# EAGLE design Blynk_Watering_System_main (EAGLE 7.5.0)
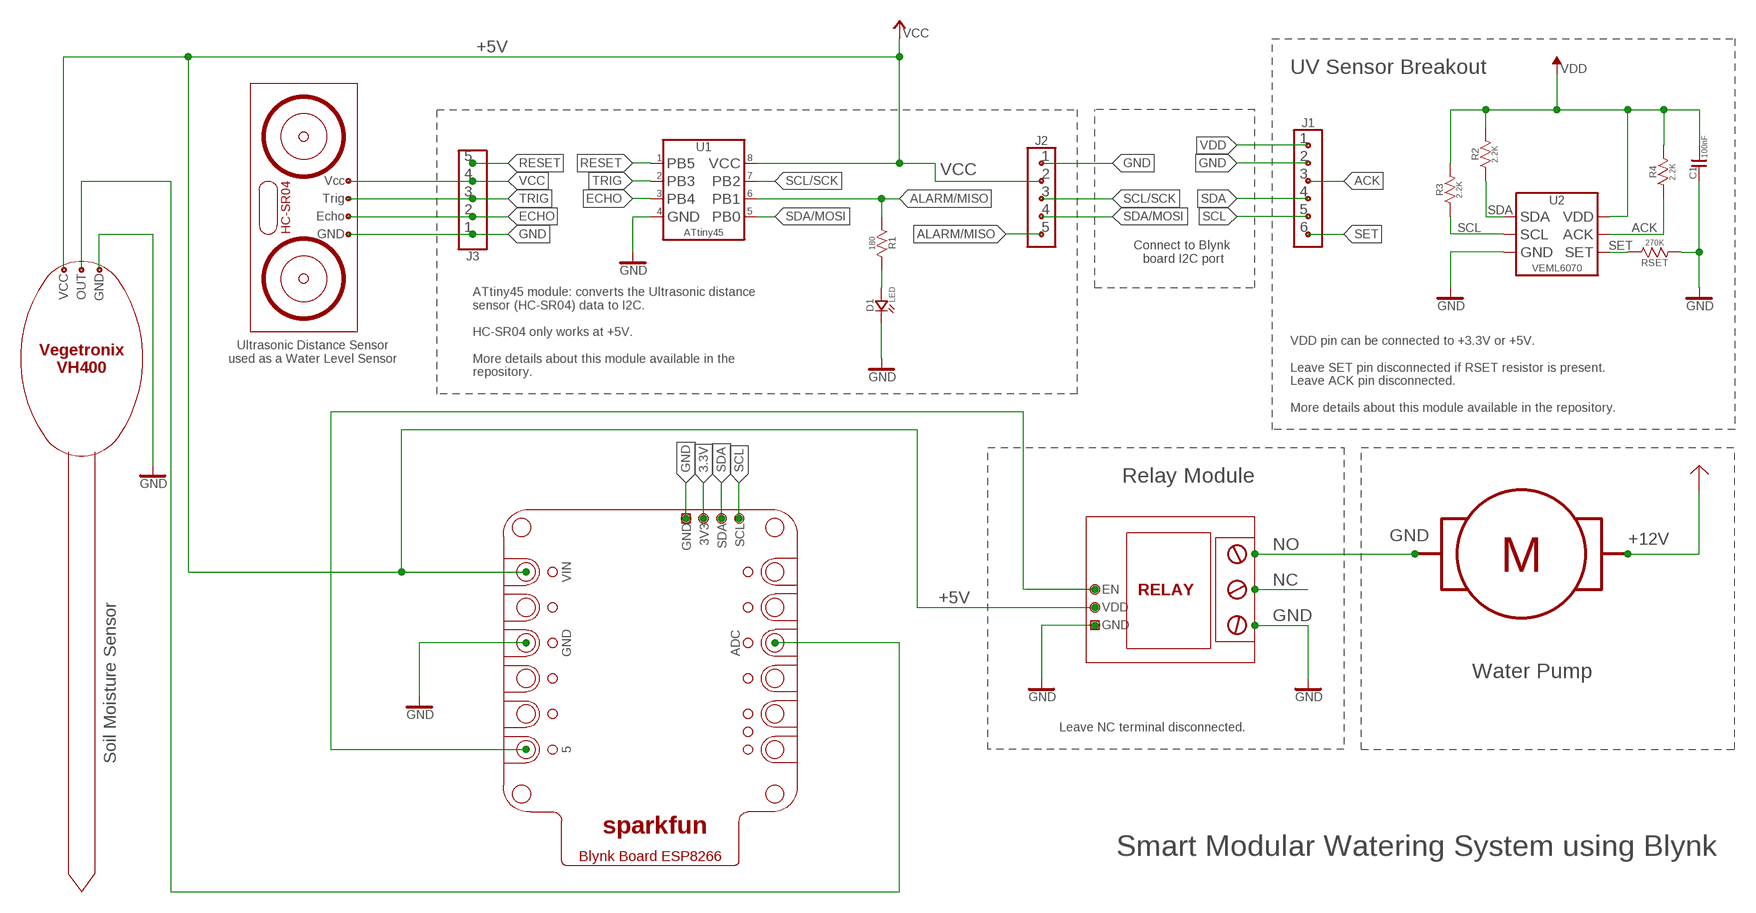
[diagram p0: schematic, sheet 1]

## Parts
C1  100nF  CAPACITOR_0603[1608]  [0603[1608]]
D1  LED  LED_0805[2012]  [0805[2012]]
J1  PIN_HEADER_1X06_0.1"_STR_G[2]_PTH  [PIN_HEADER_1X06_0.1"_STR_G[2]_PTH]
J2  PIN_HEADER_1X05_0.1"_STR_G[1]_PTH  [PIN_HEADER_1X05_0.1"_STR_G[1]_PTH]
J3  PIN_HEADER_1X05_0.1"_STR_G[1]_PTH  [PIN_HEADER_1X05_0.1"_STR_G[1]_PTH]
R1  180  RESISTOR_0603[1008]  [0603[1608]]
R2  2.2K  RESISTOR_0603[1008]  [0603[1608]]
R3  2.2K  RESISTOR_0603[1008]  [0603[1608]]
R4  2.2K  RESISTOR_0603[1008]  [0603[1608]]
RSET  270K  RESISTOR_0603[1008]  [0603[1608]]
U1  ATtiny45  ATTINY25/45/85_TSSOP_MO-153-AC  [TSSOP_MO-153-AC]
U2  VEML6070  UV_LIGHT_SENSOR_I2C_OPLGA  [OPLGA]

## Nets
ACK: J1.3 R4.1 U2.2(ACK)
ALARM/MISO: J2.5 R1.1 U1.6(PB1)
ECHO: J3.2 U1.3(PB4)
GND: C1.1 D1.- J1.2 J2.1 J3.1 RSET.1 U1.4(GND) U2.1(GND)
N$9: D1.+ R1.2
RESET: J3.5 U1.1(PB5)
SCL: J1.5 R3.1 U2.5(SCL)
SCL/SCK: J2.3 U1.7(PB2)
SDA: J1.4 R2.1 U2.3(SDA)
SDA/MOSI: J2.4 U1.5(PB0)
SET: J1.6 RSET.2 U2.4(SET)
TRIG: J3.3 U1.2(PB3)
VCC: J2.2 J3.4 U1.8(VCC)
VDD: C1.2 J1.1 R2.2 R3.2 R4.2 U2.6(VDD)

## Notes on the sheet
- +5V
- UV Sensor Breakout
- Vcc
- Trig
- HC-SR04
- Echo
- GND
- Connect to Blynk 
  board I2C port
- VCC | OUT | GND
- Ultrasonic Distance Sensor
  used as a Water Level Sensor
- Vegetronix
  VH400
- ATtiny45 module: converts the Ultrasonic distance 
  sensor (HC-SR04) data to I2C.
  
  HC-SR04 only works at +5V.
  
  More details about this module available in the
  repository.
- VDD pin can be connected to +3.3V or +5V.
  
  Leave SET pin disconnected if RSET resistor is present.
  Leave ACK pin disconnected.
  
  More details about this module available in the repository.
- Relay Module
- GND | 3V3 | SDA | SCL
- GND
- M
- VIN
- EN | RELAY
- +5V | VDD
- GND
- GND | ADC
- Soil Moisture Sensor | Water Pump
- Leave NC terminal disconnected.
- 5
- sparkfun
- Blynk Board ESP8266 | Smart Modular Watering System using Blynk

## Library data of the parts
C1 = LuisLab-Pasives:CAPACITOR
D1 = LuisLab-LED:LED: LED 5MM
J1 = LuisLab-Connectors:PIN_HEADER_1X06
J2 J3 = LuisLab-Connectors:PIN_HEADER_1X05
R1-R4 RSET = LuisLab-Pasives:RESISTOR: Sschematic elements and footprints resistors
U1 = LuisLab-IntegratedCircuits:ATTINY25/45/85: Pin Descriptions - Port B (PB5:PB0) PB0 (MOSI/DI/SDA/AIN0/OC0A/OC1A/AREF/PCINT0) PB1 (MISO/DO/AIN1/OC0B/OC1A/PCINT1) PB2 (SCK/USCK/SCL/ADC1/T0/INT0/PCINT2) PB3 (PCINT3/XTAL1/CLKI/OC1B/ADC3) PB4 (PCINT4/XTAL2/CLKO/OC1B/ADC2) PB5 (PCINT5/RESET/ADC0/dW) NOTE: TSSOP only for ATtiny45/V
U2 = LuisLab-Sensors:UV_LIGHT_SENSOR_I2C

## Board
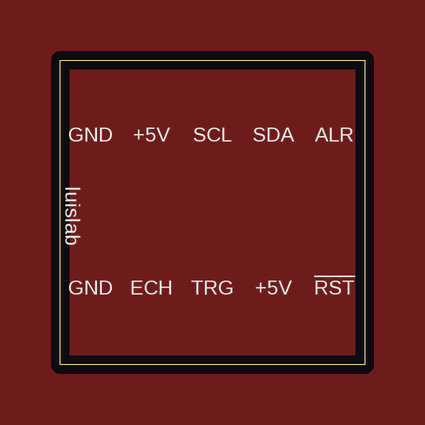
[diagram p1: board, top side]
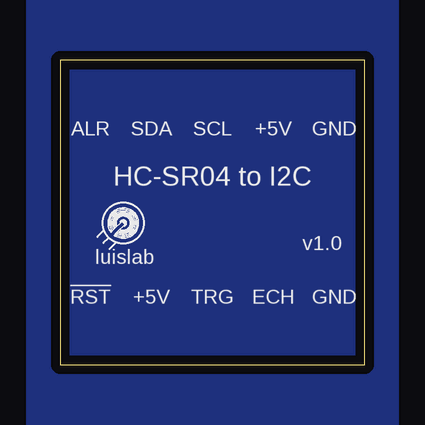
[diagram p2: board, bottom side, seen from below]

Size 12.7 x 12.7 mm. Coordinates in mm from the lower left corner, seen from the top.
Outline: 12.7,12.7 12.7,0 0,0 0,12.7 12.7,12.7
Copper layers (1*16): Top 0.0356mm / dielectric 1.5011mm / Bottom 0.0356mm
Design rules "LaenPCBOrder": minimum track width 6mil, minimum drill 13mil, track to track 6mil, track to pad 6mil, pad to pad 6mil, via to via 6mil, smd to smd 6mil, copper to edge 15mil, drill to drill 6mil, minimum pad ring 7mil, minimum via ring 7mil, stop-mask expansion 3mil, vias tented up to drill 0mil, thermal gap 10mil

### Footprints (pad centres in the part's own frame; a part is rotated, then mirrored left to right if it is on the bottom)
0603[1608] = smd 1.1 x 1: 1 -0.85,0; 2 0.85,0
0805[2012] = smd 1.2 x 1.2: + 1.05,0; - -1.05,0
PIN_HEADER_1X06_0.1"_STR_G[2]_PTH = drill 1.016 pad 1.7: 1 -6.35,0; 3 -1.27,0; 4 1.27,0; 5 3.81,0; 6 6.35,0 | drill 1.016 pad 1.6 square: 2 -3.81,0
PIN_HEADER_1X05_0.1"_STR_G[1]_PTH = drill 1.016 pad 1.6 square: 1 -6.35,0 | drill 1.016 pad 1.7: 2 -3.81,0; 3 -1.27,0; 4 1.27,0; 5 3.81,0
TSSOP_MO-153-AC = smd 0.35 x 1.45: 1 -0.975,-2.825; 2 -0.325,-2.825; 3 0.325,-2.825; 4 0.975,-2.825; 5 0.975,2.825; 6 0.325,2.825; 7 -0.325,2.825; 8 -0.975,2.825
OPLGA = smd 1 x 0.4: 1 -1.125,0.6; 2 -1.125,0; 3 -1.125,-0.6; 4 1.125,-0.6; 5 1.125,0; 6 1.125,0.6

### Placement (x,y rotation side)
C1  11.43,-6.35 0 top  (outside the outline)
D1  7.62,-6.35 0 top  (outside the outline)
J1  5.08,-21.59 0 top  (outside the outline)
J2  5.08,-25.4 0 top  (outside the outline)
J3  5.08,-29.21 0 top  (outside the outline)
R1  -2.54,-13.97 0 top  (outside the outline)
R2  1.27,-13.97 0 top  (outside the outline)
R3  5.08,-13.97 0 top  (outside the outline)
R4  8.89,-13.97 0 top  (outside the outline)
RSET  -2.54,-17.78 0 top  (outside the outline)
U1  -2.54,-7.62 0 top  (outside the outline)
U2  2.54,-6.35 0 top  (outside the outline)

### Tracks (layer width: path | path; a pad name or v marks a point on that pad's centre or on a via)
ACK  (2 unrouted)
ALARM/MISO  (2 unrouted)
ECHO  (1 unrouted)
GND  (7 unrouted)
  pour Bottom (isolate 0.305, rank 6): -1.27,17.78 13.97,17.78 13.97,-3.81 -1.27,-3.81
  pour Top (isolate 0.305, rank 6): -5.08,-2.54 17.78,-2.54 17.78,15.24 -5.08,15.24
N$9  (1 unrouted)
RESET  (1 unrouted)
SCL  (2 unrouted)
SCL/SCK  (1 unrouted)
SDA  (2 unrouted)
SDA/MOSI  (1 unrouted)
SET  (2 unrouted)
TRIG  (1 unrouted)
VCC  (2 unrouted)
VDD  (5 unrouted)

### Text on the board
tPlace: GND | +5V | SCL | SDA | ALR | luislab | GND | ECH | TRG | +5V | !RST!
bPlace: GND | +5V | SCL | SDA | ALR | HC-SR04 to I2C | v1.0 | luislab | GND | ECH | TRG | +5V | !RST!